# EAGLE design LAD_1_1 (EAGLE 8.3.2)
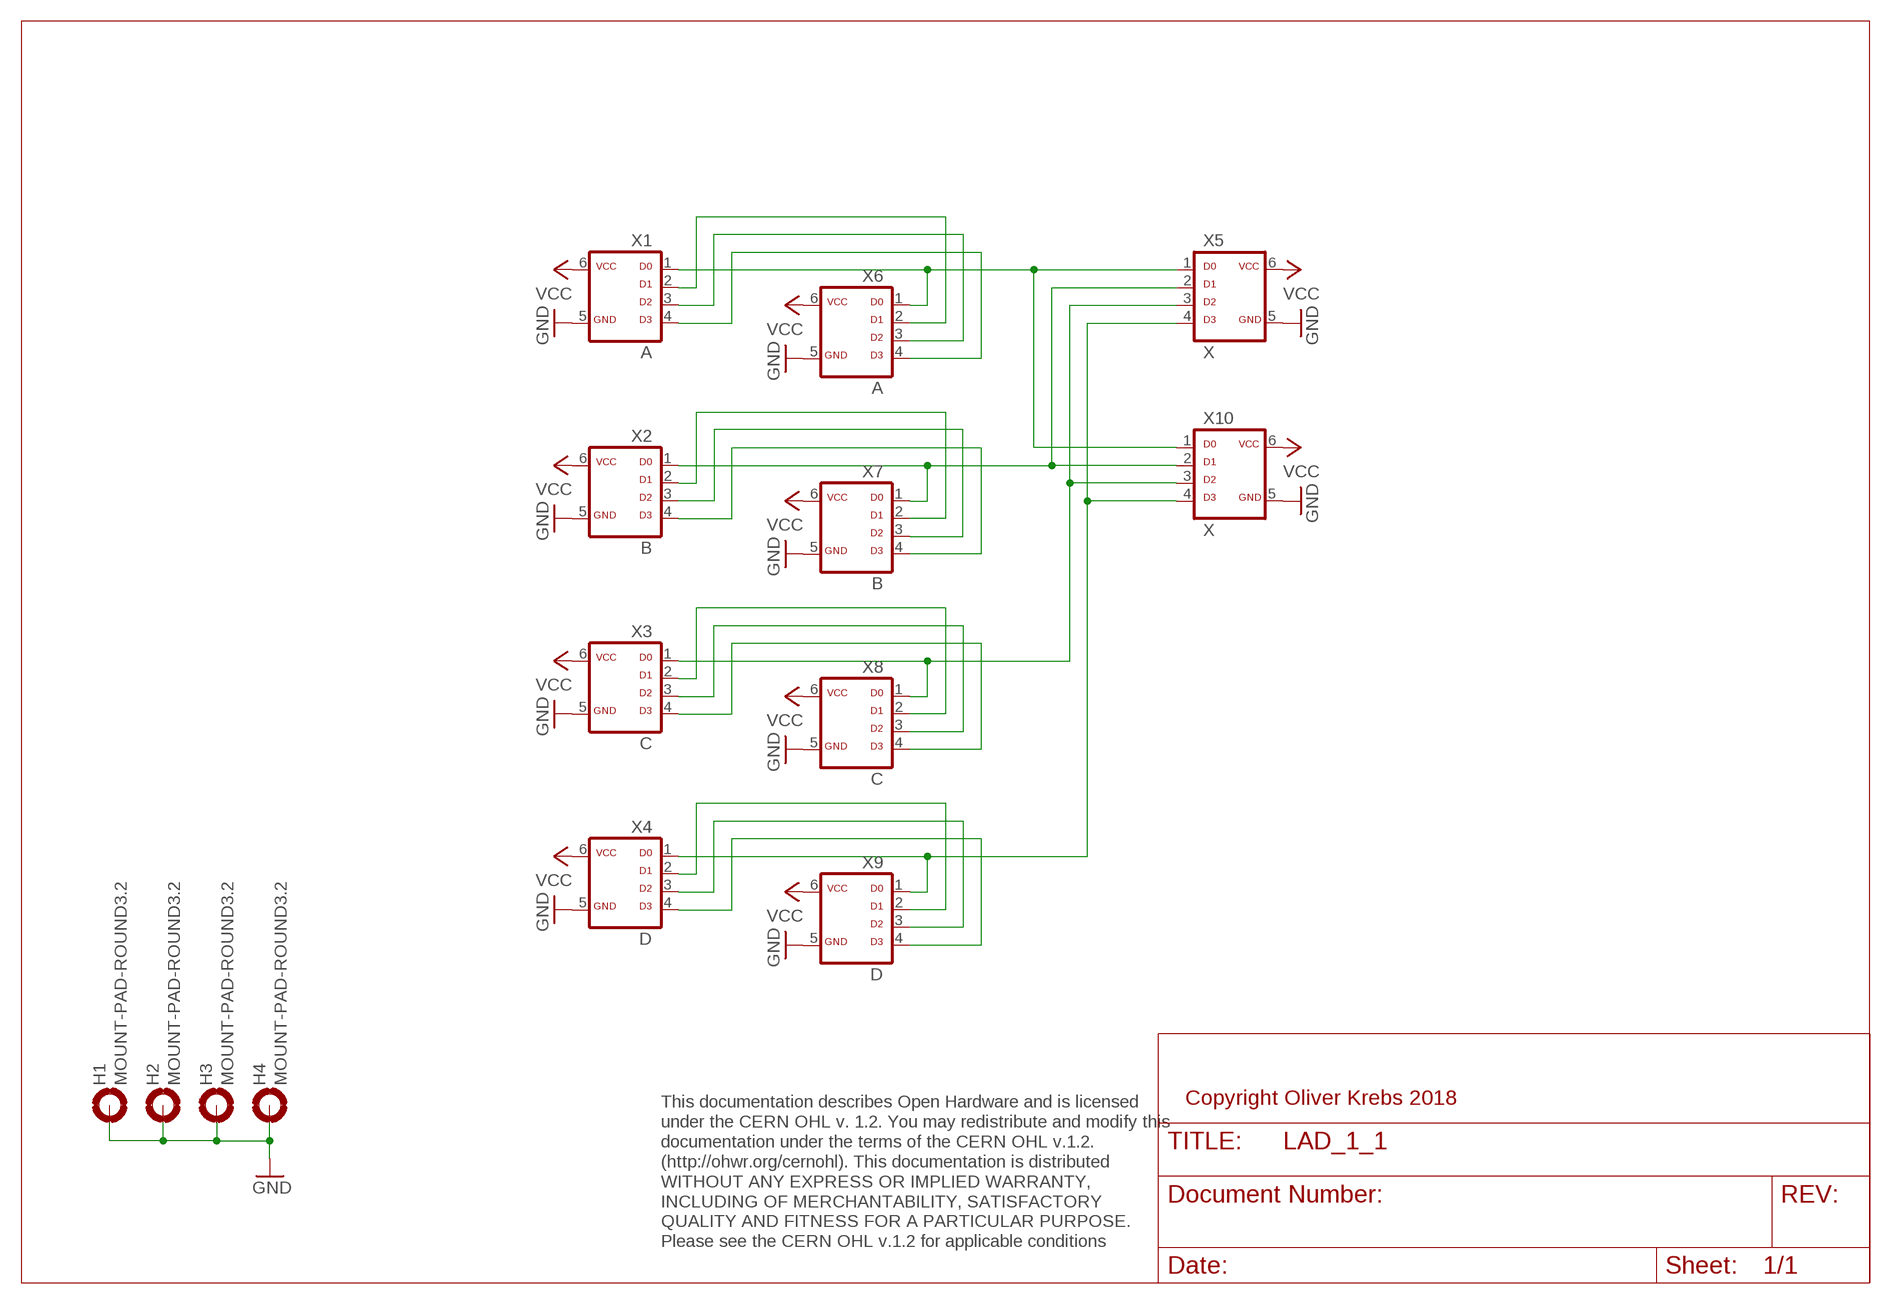
[diagram p0: schematic, sheet 1]

## Parts
H1  MOUNT-PAD-ROUND3.2  [3,2-PAD]
H2  MOUNT-PAD-ROUND3.2  [3,2-PAD]
H3  MOUNT-PAD-ROUND3.2  [3,2-PAD]
H4  MOUNT-PAD-ROUND3.2  [3,2-PAD]
X1  A  ML6D  [ML-6]
X2  B  ML6D  [ML-6]
X3  C  ML6D  [ML-6]
X4  D  ML6D  [ML-6]
X5  X  ML6D  [ML-6]
X6  A  ML6D  [ML-6]
X7  B  ML6D  [ML-6]
X8  C  ML6D  [ML-6]
X9  D  ML6D  [ML-6]
X10  X  ML6D  [ML-6]

## Nets
GND: H1.B3,2(MOUNT) H2.B3,2(MOUNT) H3.B3,2(MOUNT) H4.B3,2(MOUNT) X1.5 X2.5 X3.5 X4.5 X5.5 X6.5 X7.5 X8.5 X9.5 X10.5
N$1: X1.2 X6.2
N$2: X1.3 X6.3
N$3: X1.4 X6.4
N$4: X4.1 X5.4 X9.1 X10.4
N$5: X2.4 X7.4
N$6: X3.1 X5.3 X8.1 X10.3
N$7: X2.1 X5.2 X7.1 X10.2
N$8: X1.1 X5.1 X6.1 X10.1
N$9: X2.3 X7.3
N$10: X2.2 X7.2
N$11: X3.2 X8.2
N$12: X3.3 X8.3
N$13: X3.4 X8.4
N$14: X4.2 X9.2
N$15: X4.3 X9.3
N$16: X4.4 X9.4
VCC: X1.6 X2.6 X3.6 X4.6 X5.6 X6.6 X7.6 X8.6 X9.6 X10.6

## Notes on the sheet
- Copyright Oliver Krebs 2018
- This documentation describes Open Hardware and is licensed 
  under the CERN OHL v. 1.2. You may redistribute and modify this 
  documentation under the terms of the CERN OHL v.1.2. 
  (http://ohwr.org/cernohl). This documentation is distributed
  WITHOUT ANY EXPRESS OR IMPLIED WARRANTY, 
  INCLUDING OF MERCHANTABILITY, SATISFACTORY 
  QUALITY AND FITNESS FOR A PARTICULAR PURPOSE. 
  Please see the CERN OHL v.1.2 for applicable conditions

## Library data of the parts
H1-H4 = holes:MOUNT-PAD-ROUND: MOUNTING PAD, round
X1-X10 = 01-my-con:ML6D

## Board
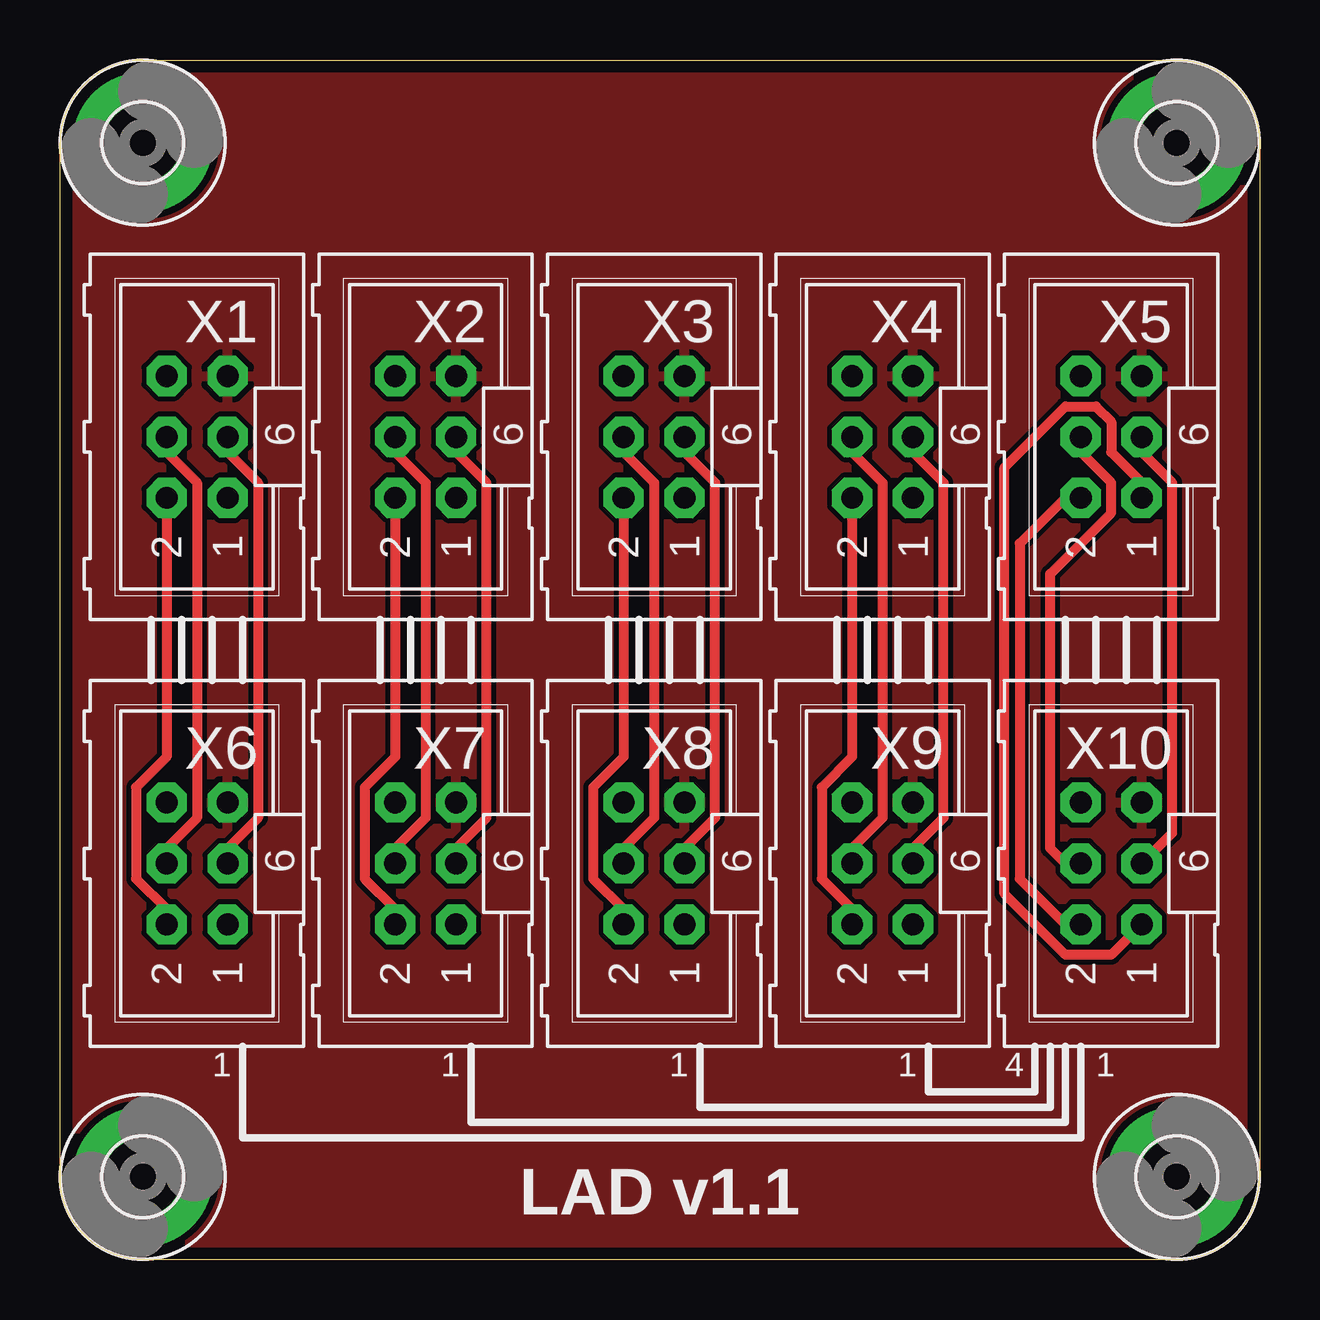
[diagram p1: board, top side]
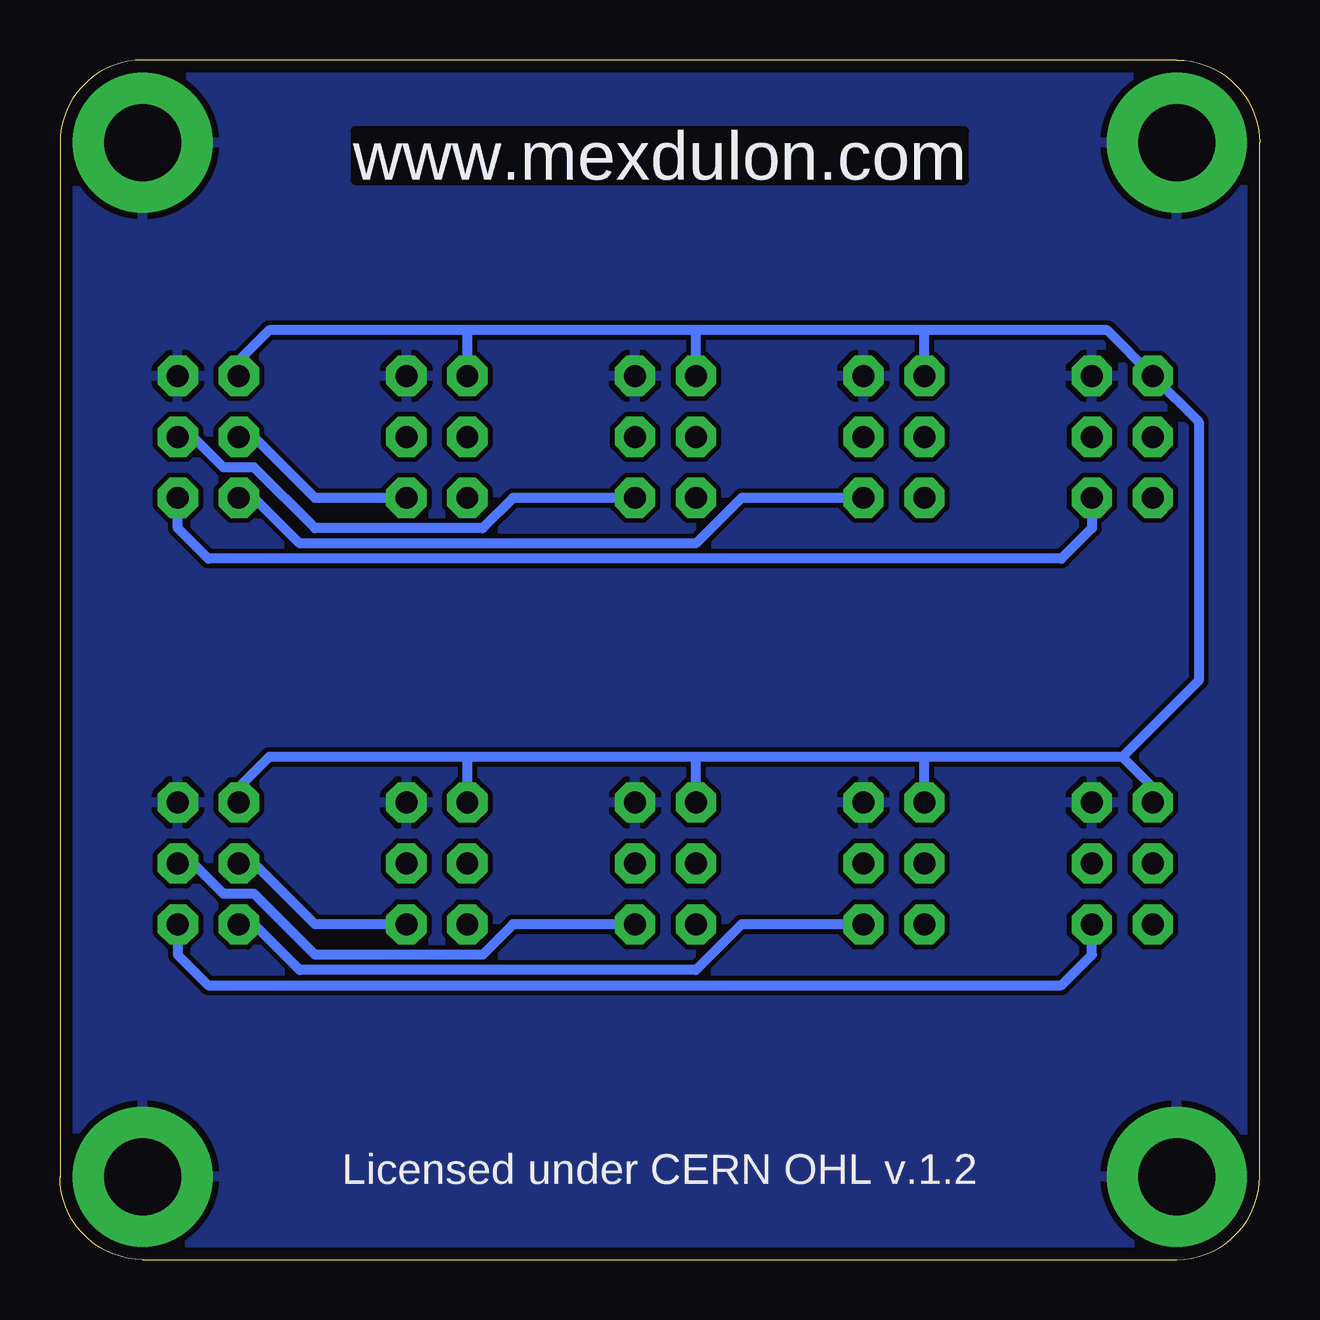
[diagram p2: board, bottom side, seen from below]

Size 50 x 50 mm. Coordinates in mm from the lower left corner, seen from the top.
Outline: 0,3.45 0,46.55 arc-90 3.45,50 46.55,50 arc-90 50,46.55 50,3.45 arc-90 46.55,0 3.45,0 arc-90 0,3.45
Copper layers (1*16): Top 0.035mm / dielectric 1.6mm / Bottom 0.035mm
Design rules "Elecrow_2-layer_PCB_eagle_rule *": minimum track width 6mil, minimum drill 12mil, track to track 8mil, track to pad 8mil, pad to pad 8mil, via to via 8mil, smd to smd 0mil, copper to edge 20mil, drill to drill 10mil, minimum pad ring 6mil, minimum via ring 6mil, stop-mask expansion 0mil, vias tented up to drill 100mil, thermal gap 10mil

### Footprints (pad centres in the part's own frame; a part is rotated, then mirrored left to right if it is on the bottom)
3,2-PAD = drill 3.2 pad 5.842: B3,2 0,0
ML-6 = drill 0.914 pad 1.676 octagon: 1 -2.54,-1.27; 2 -2.54,1.27; 3 0,-1.27; 4 0,1.27; 5 2.54,-1.27; 6 2.54,1.27

### Placement (x,y rotation side)
H1  3.45,3.45 0 top
H2  3.45,46.55 0 top
H3  46.55,46.55 0 top
H4  46.55,3.45 0 top
X1  5.71,34.29 90 top
X2  15.24,34.29 90 top
X3  24.77,34.29 90 top
X4  34.29,34.29 90 top
X5  43.81,34.29 90 top
X6  5.71,16.51 90 top
X7  15.24,16.51 90 top
X8  24.77,16.51 90 top
X9  34.29,16.51 90 top
X10  43.81,16.51 90 top

### Tracks (layer width: path | path; a pad name or v marks a point on that pad's centre or on a via)
GND
  pour Bottom: 0,0 50.8,0 50.8,50.8 0,50.8
  pour Top: 0,50.16 50.16,50.16 50.16,0 0,0
N$1
  Top 0.406: X1.2 4.45,20.95 3.17,19.68 3.17,15.88 4.45,14.61 X6.2
N$2
  Top 0.406: X1.3 6.99,33.66 8.26,32.38 8.26,18.41 6.99,17.14 X6.3
N$3
  Top 0.406: X1.4 4.45,33.66 5.71,32.38 5.71,18.41 4.45,17.14 X6.4
N$4
  Top 0.406: X5.4 42.55,33.66 43.81,32.38 43.81,31.11 41.27,28.57 41.27,17.14 41.91,16.51 X10.4
  Bottom 0.406: X4.1 39.37,31.75 41.91,34.29 X5.4 | X9.1 39.37,13.97 41.91,16.51 X10.4
N$5
  Top 0.406: X2.4 13.97,33.66 15.24,32.38 15.24,18.41 13.97,17.14 X7.4
N$6
  Top 0.406: X5.3 45.09,33.66 46.35,32.38 46.35,17.78 X10.3
  Bottom 0.406: X3.1 31.11,31.75 32.38,30.48 39.37,30.48 41.91,33.02 43.18,33.02 44.45,34.29 X5.3 | X8.1 31.11,13.97 32.38,12.7 39.37,12.7 41.91,15.24 43.18,15.24 44.45,16.51 X10.3
N$7
  Top 0.406: X10.2 41.91,13.97 40.01,15.88 40.01,29.84 41.91,31.75 X5.2
  Bottom 0.406: X2.1 21.59,31.75 23.5,29.84 40.01,29.84 41.91,31.75 X5.2 | X7.1 21.59,13.97 23.5,12.06 40.01,12.06 41.91,13.97 X10.2
N$8
  Top 0.406: X10.1 43.81,12.7 41.91,12.7 39.37,15.24 39.37,33.02 41.91,35.56 43.18,35.56 43.81,34.92 43.81,33.66 45.09,32.38 X5.1
  Bottom 0.406: X1.1 6.99,30.48 8.26,29.21 43.81,29.21 45.09,30.48 X5.1 | X10.1 45.09,12.7 43.81,11.43 8.26,11.43 6.99,12.7 X6.1
N$9
  Top 0.406: X7.3 16.51,17.14 17.78,18.41 17.78,32.38 16.51,33.66 X2.3
N$10
  Top 0.406: X2.2 13.97,20.95 12.7,19.68 12.7,15.88 13.97,14.61 X7.2
N$11
  Top 0.406: X3.2 23.5,20.95 22.23,19.68 22.23,15.88 23.5,14.61 X8.2
N$12
  Top 0.406: X8.3 26.04,17.14 27.3,18.41 27.3,32.38 26.04,33.66 X3.3
N$13
  Top 0.406: X3.4 23.5,33.66 24.77,32.38 24.77,18.41 23.5,17.14 X8.4
N$14
  Top 0.406: X4.2 33.02,20.95 31.75,19.68 31.75,15.88 33.02,14.61 X9.2
N$15
  Top 0.406: X9.3 35.56,17.14 36.83,18.41 36.83,32.38 35.56,33.66 X4.3
N$16
  Top 0.406: X4.4 33.02,33.66 34.29,32.38 34.29,18.41 33.02,17.14 X9.4
VCC
  Bottom 0.406: X6.6 4.45,19.68 5.71,20.95 | 5.71,20.95 13.97,20.95 | 13.97,20.95 23.5,20.95 | 23.5,20.95 33.02,20.95 | 33.02,20.95 41.27,20.95 42.55,19.68 X10.6 | X9.6 33.02,20.95 | X8.6 23.5,20.95 | X7.6 13.97,20.95 | 13.97,38.73 6.35,38.73 X1.6 2.54,34.92 2.54,24.13 5.71,20.95 | 13.97,38.73 23.5,38.73 | 23.5,38.73 33.02,38.73 | 33.02,38.73 41.27,38.73 42.55,37.47 X5.6 | X4.6 33.02,38.73 | X3.6 23.5,38.73 | X2.6 13.97,38.73

### Text on the board
Bottom: www.mexdulon.com
tPlace: 1 | 1 | 1 | 1 | 4 | 1 | LAD v1.1
bNames: www.mexdulon.com | Licensed under CERN OHL v.1.2